# Altium schematic sheet Sheet1.SchDoc
size A4
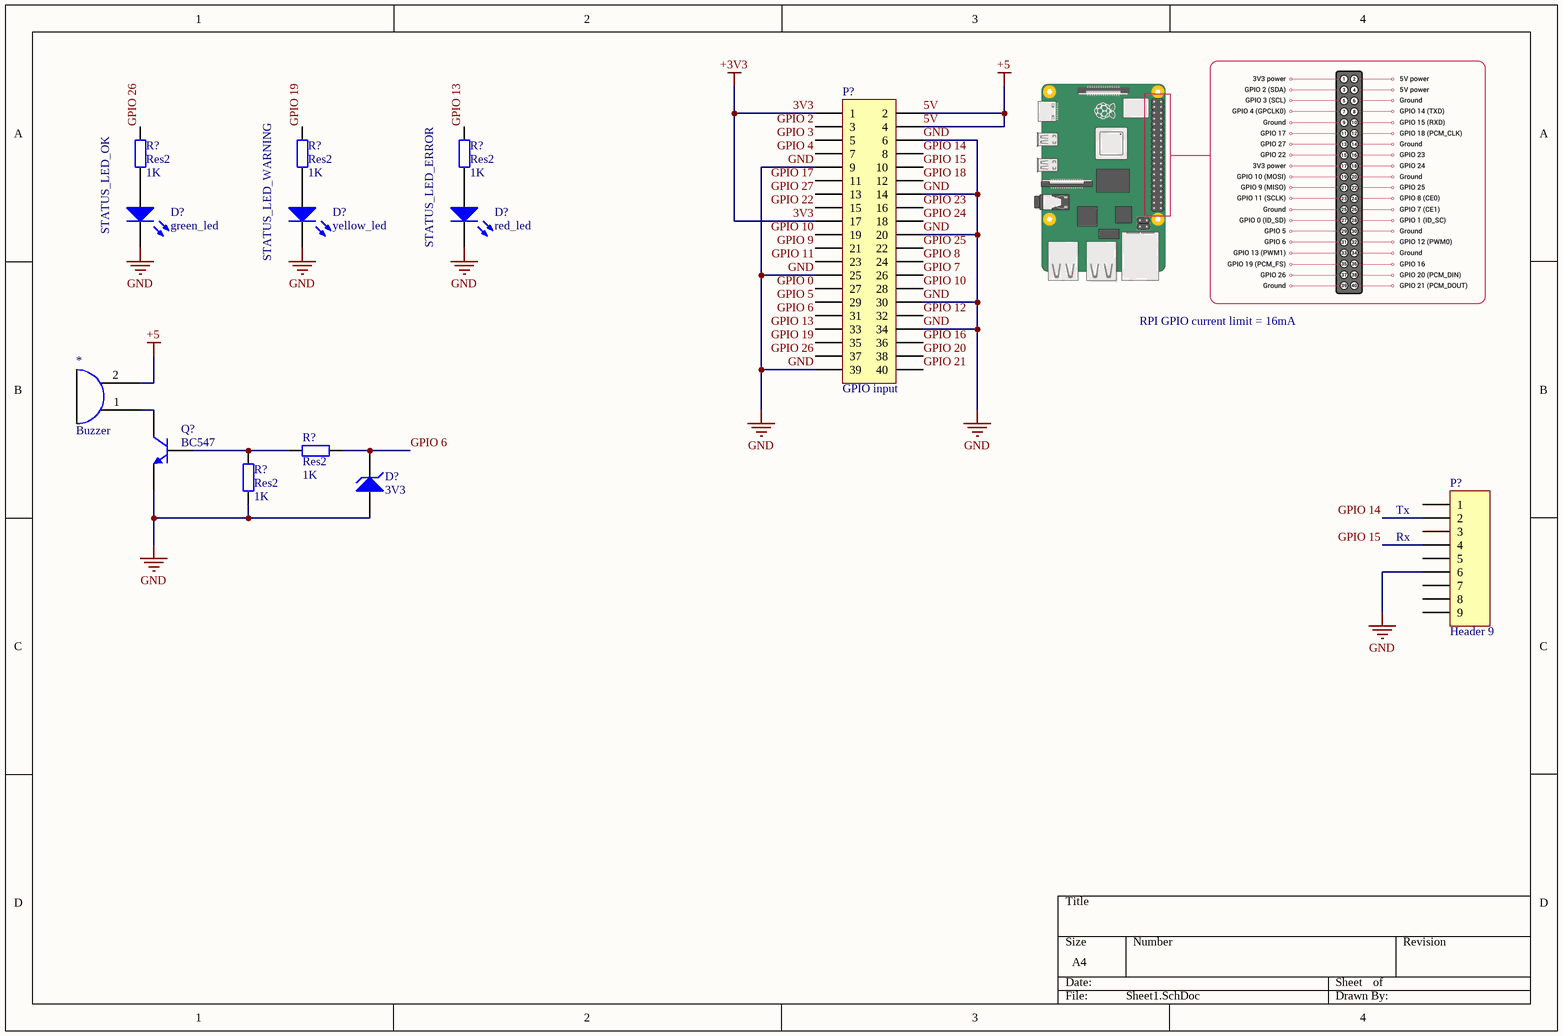
[diagram p0: Sheet1.SchDoc]

## Parts
(Parts that share a designator on the sheet are numbered #1, #2 ... from top to bottom, then left to right.)
*  Buzzer
D?#1  green_led  [3.2X1.6X1.1]
D?#2  yellow_led  [3.2X1.6X1.1]
D?#3  red_led  [3.2X1.6X1.1]
D?#4  3V3  [DIODE-0.7]
P?#1  GPIO input  [HDR2X20]
P?#2  Header 9  [HDR1X9]
Q?  BC547  [TO-226-AA]
R?#1  Res2  value 1K  [AXIAL-0.4]
R?#2  Res2  value 1K  [AXIAL-0.4]
R?#3  Res2  value 1K  [AXIAL-0.4]
R?#4  Res2  value 1K  [AXIAL-0.4]
R?#5  Res2  value 1K  [AXIAL-0.4]

## Nets
3V3: P?#1.1 P?#1.17  [also labelled +3V3]
5V: *.2 P?#1.2 P?#1.4  [also labelled +5]
GND: D?#1.2(K) D?#2.2(K) D?#3.2(K) D?#4.1(A) P?#1.6 P?#1.9 P?#1.14 P?#1.20 P?#1.25 P?#1.30 P?#1.34 P?#1.39 P?#2.6 Q?.3(E) R?#5.1
GPIO 0: P?#1.27
GPIO 2: P?#1.3
GPIO 3: P?#1.5
GPIO 4: P?#1.7
GPIO 5: P?#1.29
GPIO 6: D?#4.2(K) P?#1.31 R?#4.1
GPIO 7: P?#1.26
GPIO 8: P?#1.24
GPIO 9: P?#1.21
GPIO 10: P?#1.19 P?#1.28
GPIO 11: P?#1.23
GPIO 12: P?#1.32
GPIO 13: P?#1.33 R?#3.2
GPIO 14: P?#1.8 P?#2.2
GPIO 15: P?#1.10 P?#2.4
GPIO 16: P?#1.36
GPIO 17: P?#1.11
GPIO 18: P?#1.12
GPIO 19: P?#1.35 R?#2.2
GPIO 20: P?#1.38
GPIO 21: P?#1.40
GPIO 22: P?#1.15
GPIO 23: P?#1.16
GPIO 24: P?#1.18
GPIO 25: P?#1.22
GPIO 26: P?#1.37 R?#1.2
GPIO 27: P?#1.13
Net*_1: *.1 Q?.1(C)
NetD?#1_1: D?#1.1(A) R?#1.1
NetD?#2_1: D?#2.1(A) R?#2.1
NetD?#3_1: D?#3.1(A) R?#3.1
NetQ?_2: Q?.2(B) R?#4.2 R?#5.2

Not connected (* = marked no-connect by the designer): P?#2 1 3 5 7 8 9

## Notes on the sheet
- STATUS_LED_OK
- STATUS_LED_ERROR
- STATUS_LED_WARNING
- RPI GPIO current limit = 16mA
- (near P?#2) Tx
- (near P?#2) Rx

## Library data of the parts
D?#1-D?#3 = LED2: Typical RED, GREEN, YELLOW, AMBER GaAs LED; Published: 8-Jun-2000; LatestRevisionDate: 17-Jul-2002; LatestRevisionNote: Re-released for DXP Platform.; PackageVersion: Feb-2002; PackageReference: 3.2X1.6X1.1; Publisher: Altium Limited; PackageDescription: SM LED; 2 Flat Leads
D?#4 = D Zener: Zener Diode; Published: 8-Jun-2000; LatestRevisionDate: 17-Jul-2002; LatestRevisionNote: Re-released for DXP Platform.; PackageReference: DIODE-0.7; Publisher: Altium Limited; PackageDescription: Diode, Thru-Hole; 2 Leads; 0.7 in Pin Spacing
P?#1 = Header 20X2: Header, 20-Pin, Dual row; LatestRevisionDate: 17-Jul-2002; LatestRevisionNote: Re-released for DXP Platform.; Publisher: Altium Limited
P?#2 = Header 9: Header, 9-Pin; LatestRevisionDate: 17-Jul-2002; LatestRevisionNote: Re-released for DXP Platform.; Publisher: Altium Limited
Q? = NPN: NPN Bipolar Transistor; Published: 8-Jun-2000; LatestRevisionDate: 17-Jul-2002; LatestRevisionNote: Re-released for DXP Platform.; PackageReference: TO-226-AA; Publisher: Altium Limited; PackageDescription: TO, Flat Index; 3 In-Line, Axial Leads; Body Dia. 4.8mm; Leads 0.55 x 0.51 mm (max); Code_JEDEC: TO-226-AA
R?#1-R?#5 = Res2: Resistor; Published: 8-Jun-2000; LatestRevisionDate: 17-Jul-2002; LatestRevisionNote: Re-released for DXP Platform.; PackageReference: AXIAL-0.4; Publisher: Altium Limited; PackageDescription: Axial Device, Thru-Hole; 2 Leads; 0.4 in Pin Spacing